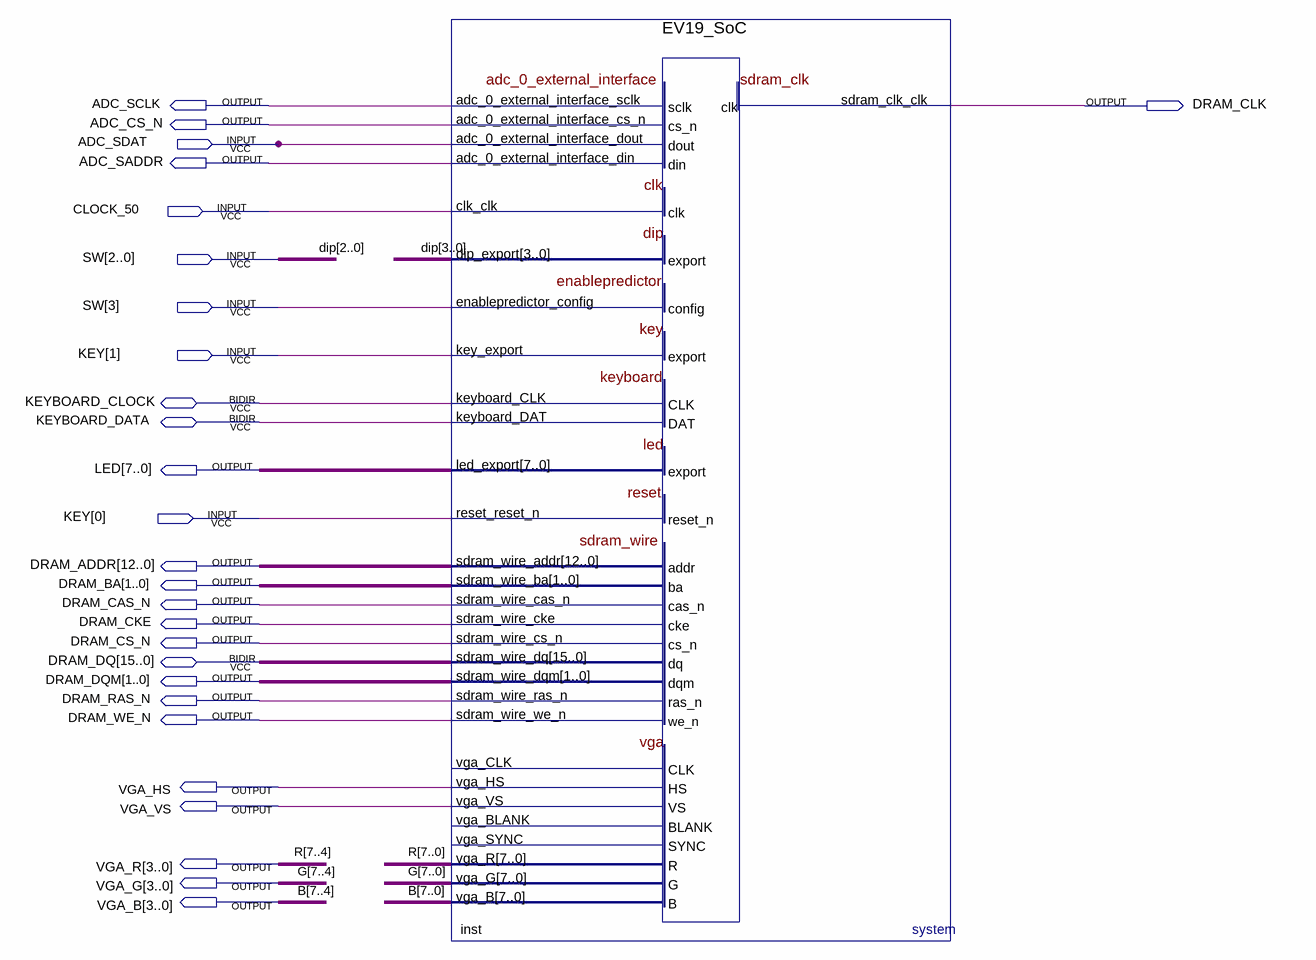
[diagram p0: schematic sheet]
// Quartus schematic TopLevel.bdf as structural Verilog: 1 symbols, 27 pins
module TopLevel (
  input  ADC_SDAT,
  input  CLOCK_50,
  input  [3:0] SW,
  input  [1:0] KEY,
  inout  KEYBOARD_CLOCK,
  inout  KEYBOARD_DATA,
  inout  [15:0] DRAM_DQ,
  output ADC_SCLK,
  output DRAM_CLK,
  output ADC_CS_N,
  output ADC_SADDR,
  output [7:0] LED,
  output [12:0] DRAM_ADDR,
  output [1:0] DRAM_BA,
  output DRAM_CAS_N,
  output DRAM_CKE,
  output DRAM_CS_N,
  output [1:0] DRAM_DQM,
  output DRAM_RAS_N,
  output DRAM_WE_N,
  output VGA_HS,
  output VGA_VS,
  output [3:0] VGA_R,
  output [3:0] VGA_G,
  output [3:0] VGA_B
);

  wire [3:0] B, G, R;
  wire [3:3] dip;

  EV19_SoC inst (
    .adc_0_external_interface_dout(ADC_SDAT), .clk_clk(CLOCK_50), .dip_export({dip[3], SW[2:0]}),
    .enablepredictor_config(SW[3]), .key_export(KEY[1]), .reset_reset_n(KEY[0]),
    .adc_0_external_interface_sclk(ADC_SCLK), .adc_0_external_interface_cs_n(ADC_CS_N),
    .adc_0_external_interface_din(ADC_SADDR), .led_export(LED), .sdram_clk_clk(DRAM_CLK),
    .sdram_wire_addr(DRAM_ADDR), .sdram_wire_ba(DRAM_BA), .sdram_wire_cas_n(DRAM_CAS_N),
    .sdram_wire_cke(DRAM_CKE), .sdram_wire_cs_n(DRAM_CS_N), .sdram_wire_dqm(DRAM_DQM),
    .sdram_wire_ras_n(DRAM_RAS_N), .sdram_wire_we_n(DRAM_WE_N), .vga_HS(VGA_HS), .vga_VS(VGA_VS),
    .vga_R({VGA_R, R}), .vga_G({VGA_G, G}), .vga_B({VGA_B, B}), .keyboard_CLK(KEYBOARD_CLOCK),
    .keyboard_DAT(KEYBOARD_DATA), .sdram_wire_dq(DRAM_DQ));  // open: vga_CLK, vga_BLANK, vga_SYNC

  // Other names for the same wires on the sheet: B[7:4] = VGA_B; dip[2:0] = SW[2:0]; G[7:4] = VGA_G; R[7:4] = VGA_R
endmodule
